# Altium project PCB_Redesign.PrjPcb
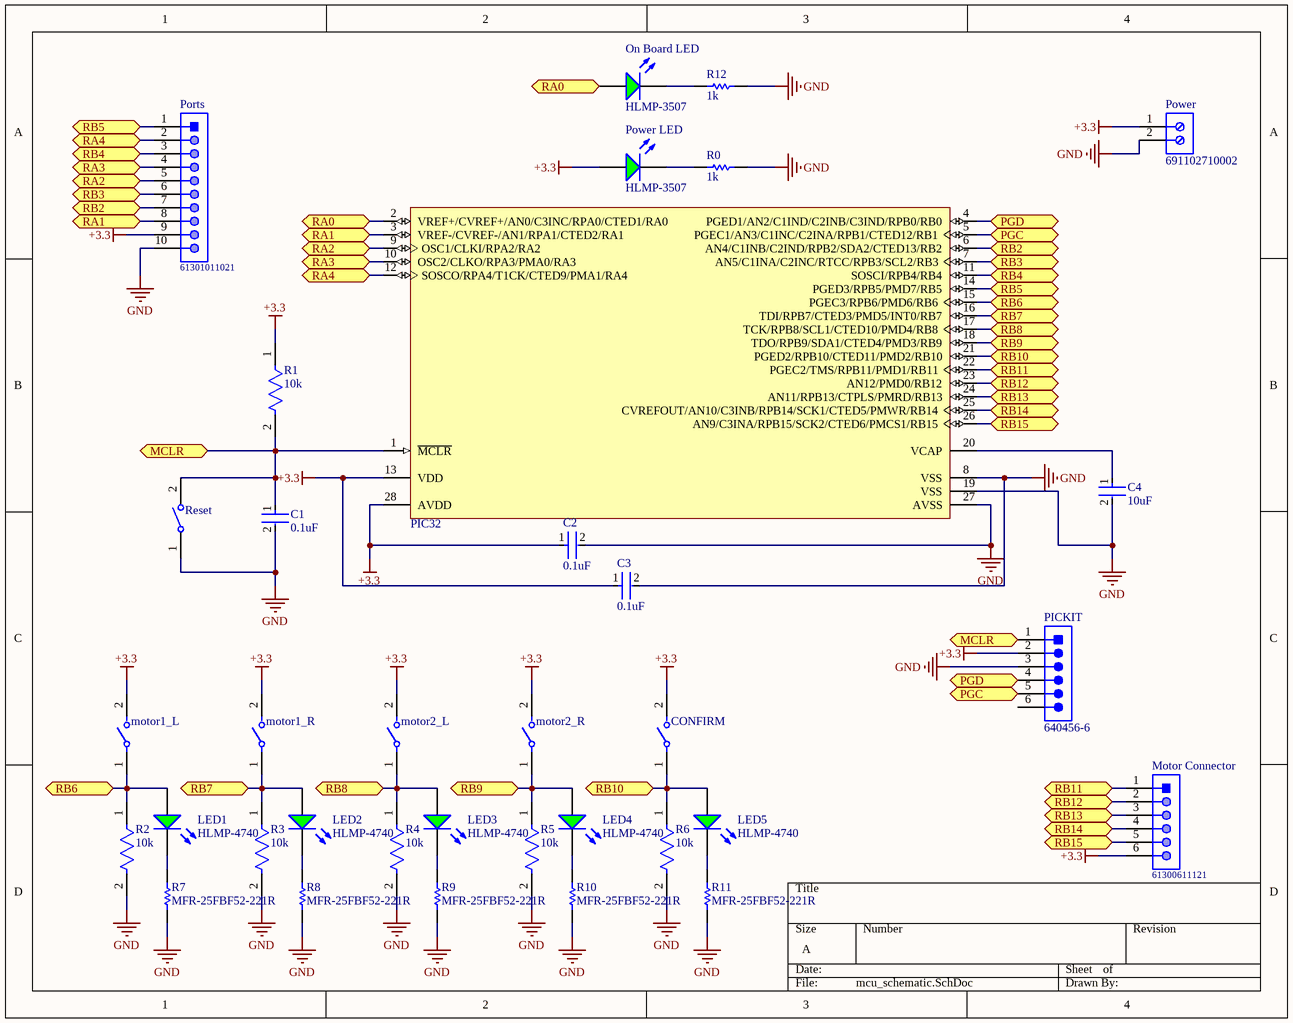
[diagram p0: mcu_schematic.SchDoc]
1 sheet, 35 parts. Net scope: flat (ports and power ports of the same name join across sheets).
Board file: PCB1.PcbDoc

## Sheet mcu_schematic.SchDoc
size A; SheetNumber: 1; SheetTotal: 1

### Parts
C1  0.1uF  [FP-C322C104K5R5TA-MFG]
C2  0.1uF  [FP-C322C104K5R5TA-MFG]
C3  0.1uF  [FP-C322C104K5R5TA-MFG]
C4  10uF  [FP-C322C104K5R5TA-MFG]
CONFIRM  FSM4JRT  [FP-FSM4JRT-MFG]  (value not drawn)
LED1  HLMP-4740  [AVAG-HLMP-4740]
LED2  HLMP-4740  [AVAG-HLMP-4740]
LED3  HLMP-4740  [AVAG-HLMP-4740]
LED4  HLMP-4740  [AVAG-HLMP-4740]
LED5  HLMP-4740  [AVAG-HLMP-4740]
motor1_L  FSM4JRT  [FP-FSM4JRT-MFG]  (value not drawn)
motor1_R  FSM4JRT  [FP-FSM4JRT-MFG]  (value not drawn)
motor2_L  FSM4JRT  [FP-FSM4JRT-MFG]  (value not drawn)
motor2_R  FSM4JRT  [FP-FSM4JRT-MFG]  (value not drawn)
Motor_Connector  61300611121  [61300611121]
On_Board_LED  HLMP-3507  [AVAG-HLMP-3507]
PIC32  PIC32MX150F128B-I/SP  [MCHP-SPDIP-SP28]  (value not drawn)
PICKIT  640456-6  [TECO-640456-6_V]
Ports  61301011021  [61301011021]
Power  691102710002  [691102710002]
Power_LED  HLMP-3507  [AVAG-HLMP-3507]
R0  1k  [RESA60-630X240]
R1  10k  [FP-CF18-MFG]
R2  10k  [FP-CF18-MFG]
R3  10k  [FP-CF18-MFG]
R4  10k  [FP-CF18-MFG]
R5  10k  [FP-CF18-MFG]
R6  10k  [FP-CF18-MFG]
R7  MFR-25FBF52-221R  [RESA60-630X240]
R8  MFR-25FBF52-221R  [RESA60-630X240]
R9  MFR-25FBF52-221R  [RESA60-630X240]
R10  MFR-25FBF52-221R  [RESA60-630X240]
R11  MFR-25FBF52-221R  [RESA60-630X240]
R12  1k  [RESA60-630X240]
Reset  (no value)  [TECO-FSMSM-2_V]

### Ports
MCLR (bidir), PGC (bidir), PGD (bidir), RA0 (bidir), RA1 (bidir), RA2 (bidir), RA3 (bidir), RA4 (bidir), RB2 (bidir), RB3 (bidir), RB4 (bidir), RB5 (bidir), RB6 (bidir), RB7 (bidir), RB8 (bidir), RB9 (bidir), RB10 (bidir), RB11 (bidir), RB12 (bidir), RB13 (bidir), RB14 (bidir), RB15 (bidir)

### Nets
+3.3: C2.1 C3.1 CONFIRM.2 motor1_L.2 motor1_R.2 motor2_L.2 motor2_R.2 Motor_Connector.6 PIC32.13(VDD) PIC32.28(AVDD) PICKIT.2 Ports.9 Power.1 Power_LED.1(A) R1.1
GND: C1.2 C2.2 C3.2 C4.2 PIC32.8(VSS) PIC32.19(VSS) PIC32.27(AVSS) PICKIT.3 Ports.10 Power.2 R0.2 R2.2 R3.2 R4.2 R5.2 R6.2 R7.1 R8.1 R9.1 R10.1 R11.1 R12.2 Reset.1
NetC1_1: C1.1 PIC32.1(~{MCLR}) PICKIT.1 R1.2 Reset.2 ; port MCLR
NetC4_1: C4.1 PIC32.20(VCAP)
NetCONFIRM_1: CONFIRM.1 LED5.1(A) PIC32.21(PGED2/RPB10/CTED11/PMD2/RB10) R6.1 ; port RB10
NetLED1_1: LED1.1(A) motor1_L.1 PIC32.15(PGEC3/RPB6/PMD6/RB6) R2.1 ; port RB6
NetLED1_2: LED1.2(K) R7.2
NetLED2_1: LED2.1(A) motor1_R.1 PIC32.16(TDI/RPB7/CTED3/PMD5/INT0/RB7) R3.1 ; port RB7
NetLED2_2: LED2.2(K) R8.2
NetLED3_1: LED3.1(A) motor2_L.1 PIC32.17(TCK/RPB8/SCL1/CTED10/PMD4/RB8) R4.1 ; port RB8
NetLED3_2: LED3.2(K) R9.2
NetLED4_1: LED4.1(A) motor2_R.1 PIC32.18(TDO/RPB9/SDA1/CTED4/PMD3/RB9) R5.1 ; port RB9
NetLED4_2: LED4.2(K) R10.2
NetLED5_2: LED5.2(K) R11.2
NetMotor_Connector_1: Motor_Connector.1 PIC32.22(PGEC2/TMS/RPB11/PMD1/RB11) ; port RB11
NetMotor_Connector_2: Motor_Connector.2 PIC32.23(AN12/PMD0/RB12) ; port RB12
NetMotor_Connector_3: Motor_Connector.3 PIC32.24(AN11/RPB13/CTPLS/PMRD/RB13) ; port RB13
NetMotor_Connector_4: Motor_Connector.4 PIC32.25(CVREFOUT/AN10/C3INB/RPB14/SCK1/CTED5/PMWR/RB14) ; port RB14
NetMotor_Connector_5: Motor_Connector.5 PIC32.26(AN9/C3INA/RPB15/SCK2/CTED6/PMCS1/RB15) ; port RB15
NetOn_Board_LED_1: On_Board_LED.1(A) PIC32.2(VREF+/CVREF+/AN0/C3INC/RPA0/CTED1/RA0) ; port RA0
NetOn_Board_LED_2: On_Board_LED.2(K) R12.1
NetPIC32_3: PIC32.3(VREF-/CVREF-/AN1/RPA1/CTED2/RA1) Ports.8 ; port RA1
NetPIC32_4: PIC32.4(PGED1/AN2/C1IND/C2INB/C3IND/RPB0/RB0) PICKIT.4 ; port PGD
NetPIC32_5: PIC32.5(PGEC1/AN3/C1INC/C2INA/RPB1/CTED12/RB1) PICKIT.5 ; port PGC
NetPIC32_6: PIC32.6(AN4/C1INB/C2IND/RPB2/SDA2/CTED13/RB2) Ports.7 ; port RB2
NetPIC32_7: PIC32.7(AN5/C1INA/C2INC/RTCC/RPB3/SCL2/RB3) Ports.6 ; port RB3
NetPIC32_9: PIC32.9(OSC1/CLKI/RPA2/RA2) Ports.5 ; port RA2
NetPIC32_10: PIC32.10(OSC2/CLKO/RPA3/PMA0/RA3) Ports.4 ; port RA3
NetPIC32_11: PIC32.11(SOSCI/RPB4/RB4) Ports.3 ; port RB4
NetPIC32_12: PIC32.12(SOSCO/RPA4/T1CK/CTED9/PMA1/RA4) Ports.2 ; port RA4
NetPIC32_14: PIC32.14(PGED3/RPB5/PMD7/RB5) Ports.1 ; port RB5
NetPower_LED_2: Power_LED.2(K) R0.1

Not connected (* = marked no-connect by the designer): PICKIT 6

### Library data of the parts
C1-C4 = CMP-03020-034661-1: CAP CER 0.1UF 50V X7R RADIAL / C322C104K5R5TA; Capacitance: 100nF; Dielectric Material: Ceramic; Dissipation Factor: 2.5%; Lead Length: 7mm; Tolerance: 10%; Lead Diameter: 0.51mm; Lead/Base Style: Formed Leads; Construction: RADIAL; RoHS Compliant: Yes; Voltage Rating (DC): 50V; Packaging: Bulk; Lead Free: Lead Free; Width: 0.125inch; Lead Pitch: 5.08mm; Voltage Rating: 50V; Number of Pins: 2; Radiation Hardening: No; Material: Ceramic; REACH SVHC: No SVHC; Height - Seated (Max): 0.26inch; Case/Package: Radial; Weight: 0.0625lb; Dielectric: X7R; Min Operating Temperature: -55°C; Voltage: 50V; Series: Golden Max™; Max Operating Temperature: 125°C; Height: 3.18mm; Termination: Radial; Length: 5.08mm; Depth: 3.18mm; Package Quantity: 500; Mount: Through Hole
CONFIRM motor1_L motor1_R motor2_L motor2_R = CMP-03407-000038-1: SWITCH TACTILE SPST-NO 0.05A 24V; Current Rating: 50mA; Actuator Diameter: 3.5mm; Max Voltage Rating (DC): 12V; Actuator Length: 0.055inch; Switch Travel: 0.25mm; Actuator Type: Standard; Contact Resistance: 100mR; Illumination Type: Non-Illuminated; Electrical Life: 100000Cycles; Throw Configuration: SPST; Switch Function: Off-Mom; Actuator Material: Resin; Operating Force: 1.57N; Series: FSMJRT; Min Operating Temperature: -35°C; Max Current Rating: 50mA; Termination: PC Pins; Type: Switch; Radiation Hardening: No; Max Operating Temperature: 105°C; Voltage Rating (DC): 12V; Contact Material: Copper Alloy; Contact Current Rating: 50mA; RoHS Compliant: Yes; Mechanical Life: 100000Cycles; Mount: Through Hole; Package Quantity: 10000; Case/Package: Radial; Packaging: Tape and Reel; Length: 6.19mm; Contact Plating: Silver; Depth: 6.19mm; Orientation: Straight
LED1-LED5 = CMP-2000-06413-1: T-1 3/4 (5 mm) Low Current LED Lamp, Green, 1.9 V, -20 to 100 degC, 2-Pin THD, RoHS, Bulk; Manufacturer: AvagoTechnologies; Type: Uni-Color; Peak Wavelength: 565nm; Rad Hard: No; Viewing Angle: 50°; Dominant Wavelength/Color Temperature: 569nm; Number of LEDs: 1; Lens Appearance: ColoredDiffused; Lens Shape Type: Circular; Mounting Orientation: TopMount; Intensity: 2.3mcd; Datasheet Version: 07/2014; Category: LEDs; Datasheet URL: http://docs.avagotech.com/docs/AV02-1557EN; Packaging: Bulk; Pin Count: 2; Mounting Technology: ThroughHole; Package Reference: HLMP-4740; Mounting: ThroughHole; Manufacturer URL: http://www.avagotech.com/; Color: Green; Package: 2T-13/4; Package Description: 2-Pin Through Hole Device, Dia 5.845 mm, Pitch 2.54 mm
Motor_Connector = CMP-1502-01070-1: THT Vertical Pin Header WR-PHD, Pitch 2.54 mm, Single Row, 6 pins; Manufacturer: Wurth Elektronik; Gender: Male; Pin Number: 6; Pitch: 2.54mm; Working Voltage: 250VAC; Rated Current: 3A; Withstanding Voltage: 500VAC; Contact Resistance: 20mOhm; Operating Temperature: -40to105degC; Packaging: Bag; Datasheet URL: https://katalog.we-online.de/em/datasheet/6130xx11121.pdf; Package Reference: 61300611121; Mounting Technology: THT; Publisher: WurthElektronik; Part Number: 61300611121; Manufacturer URL: http://www.we-online.de; Row Number: Single; Orientation: Vertical
On_Board_LED Power_LED = CMP-2000-06412-1: T-1 3/4 (5 mm) Diffused LED Lamp, Green, 2.1 V, -20 to 100 degC, 2-Pin THD, RoHS, Bulk; Manufacturer: Avago; Reverse Voltage: 5V; Product Depth (mm): 6.1mm; Lum Intensity: 4.2mcd; Chip Material: GaP; Emitting Color: YellowGreen; Number of  Elements: 1; Forward Voltage: 2.7V; Dominant Wave Length: 569nm; Peak Wavelength: 565nm; Rad Hardened: No; Shape Type: Circular; Forward Current: 25mA; Product Height (mm): 9.19mm; Power Dissipation: 85W; Viewing Angle: 60deg; Main Category: StandardLED; Lens Type: ColoredDiffused; Test Current (It): 10mA; DELETED: Compliant; Package Description: 2-Pin Through Hole Device, Dia 5.845 mm, Pitch 2.54 mm; Datasheet URL: http://docs.avagotech.com/docs/AV02-1558EN; Type: Uni-Color; Operating Temperature Classification: Industrial; Pin Count: 2; Datasheet Version: 03/2015; Operating Temp Range: -40Cto100C; Package Reference: HLMP-3507; Mounting: ThroughHole; Mounting Technology: ThroughHole; Manufacturer URL: http://www.avagotech.com/; High Brightness: No; Luminous Intensity: 4.2mcd; Package Type: T-13/4; Product Length (mm): 6.1mm; Lens Dimensions: 5.08x5.08x8.3mm
PIC32 = CMP-0048-00469-1: 32-bit Microcontroller with Audio and Graphics Interface, USB and Advanced Analog, 50 MHz, 21 I/O, PMP, -40 to 85 degC, 28-pin SPDIP (SP28), Tube; Manufacturer: Microchip; DatasheetVersion: Rev. E; ComponentLink1URL: http://www.microchip.com; ComponentLink3URL: http://www.microchip.com/stellent/groups/techpub_sg/documents/packagingspec/en012702.pdf; ComponentLink4URL: http://www.microchip.com/PIC32MX150F128B; PartNumber: PIC32MX150F128B-I/SP; ComponentLink3Description: Package Specification; ComponentLink2URL: http://ww1.microchip.com/downloads/en/DeviceDoc/61168E.pdf; ComponentLink2Description: Datasheet; PackageDescription: 28-Lead Plastic Dual In-Line, 34.86 x 6.79 mm Body, 2.54 mm Pitch; ComponentLink1Description: Manufacturer URL; PackageReference: SPDIP-SP28; PackageVersion: C04-070B; ComponentLink4Description: Product URL; Mounting Technology: Through Hole
PICKIT = CMP-2000-05661-1: Male Header, Pitch 2.54 mm, 1 x 6 Position, Height 10.03 mm, Tail Length 3.56 mm, -55 to 105 degC, Bulk; Manufacturer: TE Connectivity; Contact Centerline Spacing: 0.100 / in.; Number of Contacts: 6; Current, Rating: 5 / A; Agency Approvals: CSA,UL; Material, Contact: CopperAlloy; Mounting Hole Size: 0.04 / "; Brand/Series: MTA-100Series; Pin Spacing: 0.1 / "; Mount Angle: Vertical; Contact Termination Area Plating: Tin; Angle: Straight; Primary Type: InterconnectSystem; Standards: RoHSCompliant,ELVCompliant,UL94V-0; Temperature, Operating: -55to+105 / °C; Material, Housing: Polyester; Special Features: Pinstrip; Color, Housing: White; Connector Type: MTA-100; Voltage, Rating: 250 / V; Termination: Solder; Package Reference: 640456-6; Size, Post: 0.025 / in.; Color: White; Datasheet URL: https://datasheet.ciiva.com/25618/0900766b80eb7fdd-25618163.pdf; Manufacturer URL: http://www.te.com/; Mounting Type: PCMount; Length, Pin: 0.14 / "; Type: PCBPlug; Length, Overall: 0.6 / "; Mounting Technology: ThroughHole; Number of Rows: 1; Contact Shape: Square; Contact Mating Area Plating: Tin; Datasheet Version: Rev. W, 05/2005; Number of Positions: 6; Package Description: Male Header, Pitch 2.54 mm, 1 x 6 Position, Height 10.03 mm, Tail Length 3.56 mm; Contact Plating: Tin; Length, Terminal Post: 0.14 / in.; Flammability Rating: UL94V-0
Ports = CMP-1502-01081-1: THT Angled Pin Header WR-PHD, Pitch 2.54 mm, Single Row, 10 pins; Manufacturer: Wurth Elektronik; Contact Resistance: 20mOhm; Pitch: 2.54mm; Gender: Male; Withstanding Voltage: 500VAC; Rated Current: 3A; Working Voltage: 250VAC; Pin Number: 10; Manufacturer URL: http://www.we-online.de; Package Reference: 61301011021; Publisher: WurthElektronik; Part Number: 61301011021; Datasheet URL: https://katalog.we-online.de/em/datasheet/6130xx11021.pdf; Packaging: Bag; Row Number: Single; Orientation: Angled; Mounting Technology: THT; Operating Temperature: -40to105degC
Power = CMP-1502-03258-1: Series 102 - 5.00 mm Horizontal Entry Modular with Pressure Clamp WR-TBL, 2 pin; Manufacturer: Wurth Elektronik; Pin Number: 2; Pitch: 5.00mm; Manufacturer URL: http://www.we-online.de; Mounting Technology: THT; Publisher: WurthElektronik; Packaging: Box; Package Reference: 691102710002; Datasheet URL: http://katalog.we-online.de/em/datasheet/6911027100xx.pdf; Operating Temperature: -40to105degC; Part Number: 691102710002
R0 R12 = CMP-1659-00075-1: Axial Resistor, 1 KOhm, +/- 1%, 250 mW, -55 to 155 degC, 2-Pin THD, RoHS, Bulk / MFR-25FBF52-1K; Voltage Rating: 250 V; Resistance: 10 kohm; Power Rating: 250 mW; ComponentLink2Description: Datasheet; RoHSCompliant: true; PackageReference: MFR-25; Case\Package: Axial; Max Operating Temperature: 155 degC; DatasheetVersion: Apr-13; Tolerance: 1%; ComponentLink1URL: http://www.yageo.com/; Length: 0.248 inch; ComponentLink2URL: http://www.yageo.com/documents/recent/Yageo%20LR_MFR_2013.pdf; Packaging: Bulk; Package Quantity: 200; PackageDescription: 2-Pin Axial Lead, Dia 2.4 mm, Body Length 6.3 mm; Min Operating Temperature: -55 degC; ComponentLink1Description: Manufacturer URL
R1-R6 = CMP-26528-000002-1: RES 10K OHM 1/8W 5% CF AXIAL / CF18JT10K0; Manufacturer: Stackpole Electronics; Power Rating: 0.125W; Temperature Coefficient: 0-500ppm/°C; Resistance: 10kΩ; Voltage Rating: 250V; Value: 10kΩ; Temperature: -55°C to +155°C; Height: 2mm; Lead Free: Yes; Automotive: No; Device Class L2: Resistors; Package: CF18; Series: CF; ComponentLink2Description: Datasheet; Ipc Land Pattern Name: RESAD656W65L360D200; Manufacturer Part Number: CF18JT10K0; Temperature Range High: +155°C; RoHS: TRUE; Device Class L3: Through-Hole Resistors; Temperature Range Low: -55°C; Device Class L1: Passive Components; Category: Res; Octopart: https://octopart.com/cf18jt10k0-stackpole+electronics-19205642; Composition: Carbon Film; Digikey Description: RES 10K OHM 1/8W 5% CF AXIAL; ComponentLink2URL: http://www.seielect.com/Catalog/SEI-CF_CFM.pdf; Tolerance: 5%
R7-R11 = CMP-1659-00072-1: Axial Resistor, 221 Ohm, +/- 1%, 250 mW, -55 to 155 degC, 2-Pin THD, RoHS, Bulk; Max Supply Voltage: 3.6 V; Min Supply Voltage: 1.95 V; Interface: I2C; Case\Package: QFN; Nominal Supply Voltage: 2.5 V; Bandwidth: 800 Hz; Max Operating Temperature: 85 degC; Height: 0.95 mm; Mount: Surface Mount; Packaging: Tape and Reel; PackageReference: MFR-25; ComponentLink1Description: Manufacturer URL; Length: 3 mm; Min Operating Temperature: -40 degC; RoHSCompliant: true; ComponentLink2Description: Datasheet; Package Quantity: 1000; Pins: 16; ComponentLink2URL: http://www.yageo.com/documents/recent/Yageo%20LR_MFR_2013.pdf; Radiation Hardening: No; ComponentLink1URL: http://www.yageo.com/; Weight: 0.001122 oz; REACH SVHC: No SVHC; DatasheetVersion: Apr-13; PackageDescription: 2-Pin Axial Lead, Dia 2.4 mm, Body Length 6.3 mm
Reset = CMP-2000-07511-1: FSMSM Push Button Switch, 50 mA, -35 to 85 degC, 2-Pin SMD, RoHS, Bulk / FSMSM; Manufacturer: TE Connectivity; Actuator Length: 1.07mm; Electrical Life: 20000Cycles; Actuator Material: Polyamide; Current Rating: 50mA; Illumination Type: Illuminated; Voltage Rating (DC): 24V; Contact Resistance: 100mOhm; Case\/Package: SMD/SMT; Operating Force: 180gf; Switch Travel: 0.25mm; Max Voltage Rating (DC): 12V; Throw Configuration: SPST; Packaging: LoosePiece; Max Operating Temperature: 85degC; ELV: Compliant; Package Description: 2-Pin Surface Mount Device, Body 6 x 3.5 mm, Pitch 9.19 mm; RoHSCompliant: true; Manufacturer URL: http://www.te.com/; Contact Plating: Silver; Contact Material: Brass; Mounting Technology: SurfaceMount; Contact Current Rating: 50mA; Datasheet Version: Rev. C2, 08/2014; Datasheet URL: http://www.te.com/commerce/DocumentDelivery/DDEController?Action=showdoc&DocId=Customer+Drawing%7F1437566-3%7FC2%7Fpdf%7FEnglish%7FENG_CD_1437566-3_C2_1437566_3_1_c.dwg.pdf%7F1437566-3; Mechanical Life: 20000Cycles; Package Reference: FSMSM; REACH SVHC: Unknown; Orientation: Straight; Min Operating Temperature: -35degC; Lead Free: LeadFree; Termination: GullWing; Package Quantity: 1000; Mount: SurfaceMount